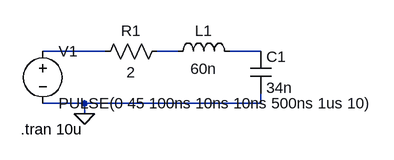
[diagram p0: schematic Draft1.asc]
Draft1.asc, the LTspice schematic file:
Version 4
SHEET 1 880 680
WIRE 48 128 -48 128
WIRE 160 128 128 128
WIRE 288 128 240 128
WIRE 16 208 -48 208
WIRE 288 208 288 192
WIRE 288 208 16 208
WIRE 16 224 16 208
FLAG 16 224 0
SYMBOL res 144 112 R90
WINDOW 0 0 56 VBottom 2
WINDOW 3 32 56 VTop 2
SYMATTR InstName R1
SYMATTR Value 2
SYMBOL ind 144 144 R270
WINDOW 0 32 56 VTop 2
WINDOW 3 5 56 VBottom 2
SYMATTR InstName L1
SYMATTR Value 60n
SYMBOL cap 272 128 R0
SYMATTR InstName C1
SYMATTR Value 34n
SYMBOL voltage -48 112 R0
WINDOW 123 0 0 Left 0
WINDOW 39 0 0 Left 0
SYMATTR InstName V1
SYMATTR Value PULSE(0 45 100ns 10ns 10ns 500ns 1us 10)
TEXT -82 248 Left 2 !.tran 10u

The netlist it stands for:
* Draft1.asc
R1 N002 N001 2
L1 N002 N003 60n
C1 N003 0 34n
V1 N001 0 PULSE(0 45 100ns 10ns 10ns 500ns 1us 10)
.tran 10u
.backanno
.end